# EAGLE schematic 16 seg display board (EAGLE 9.6.1)
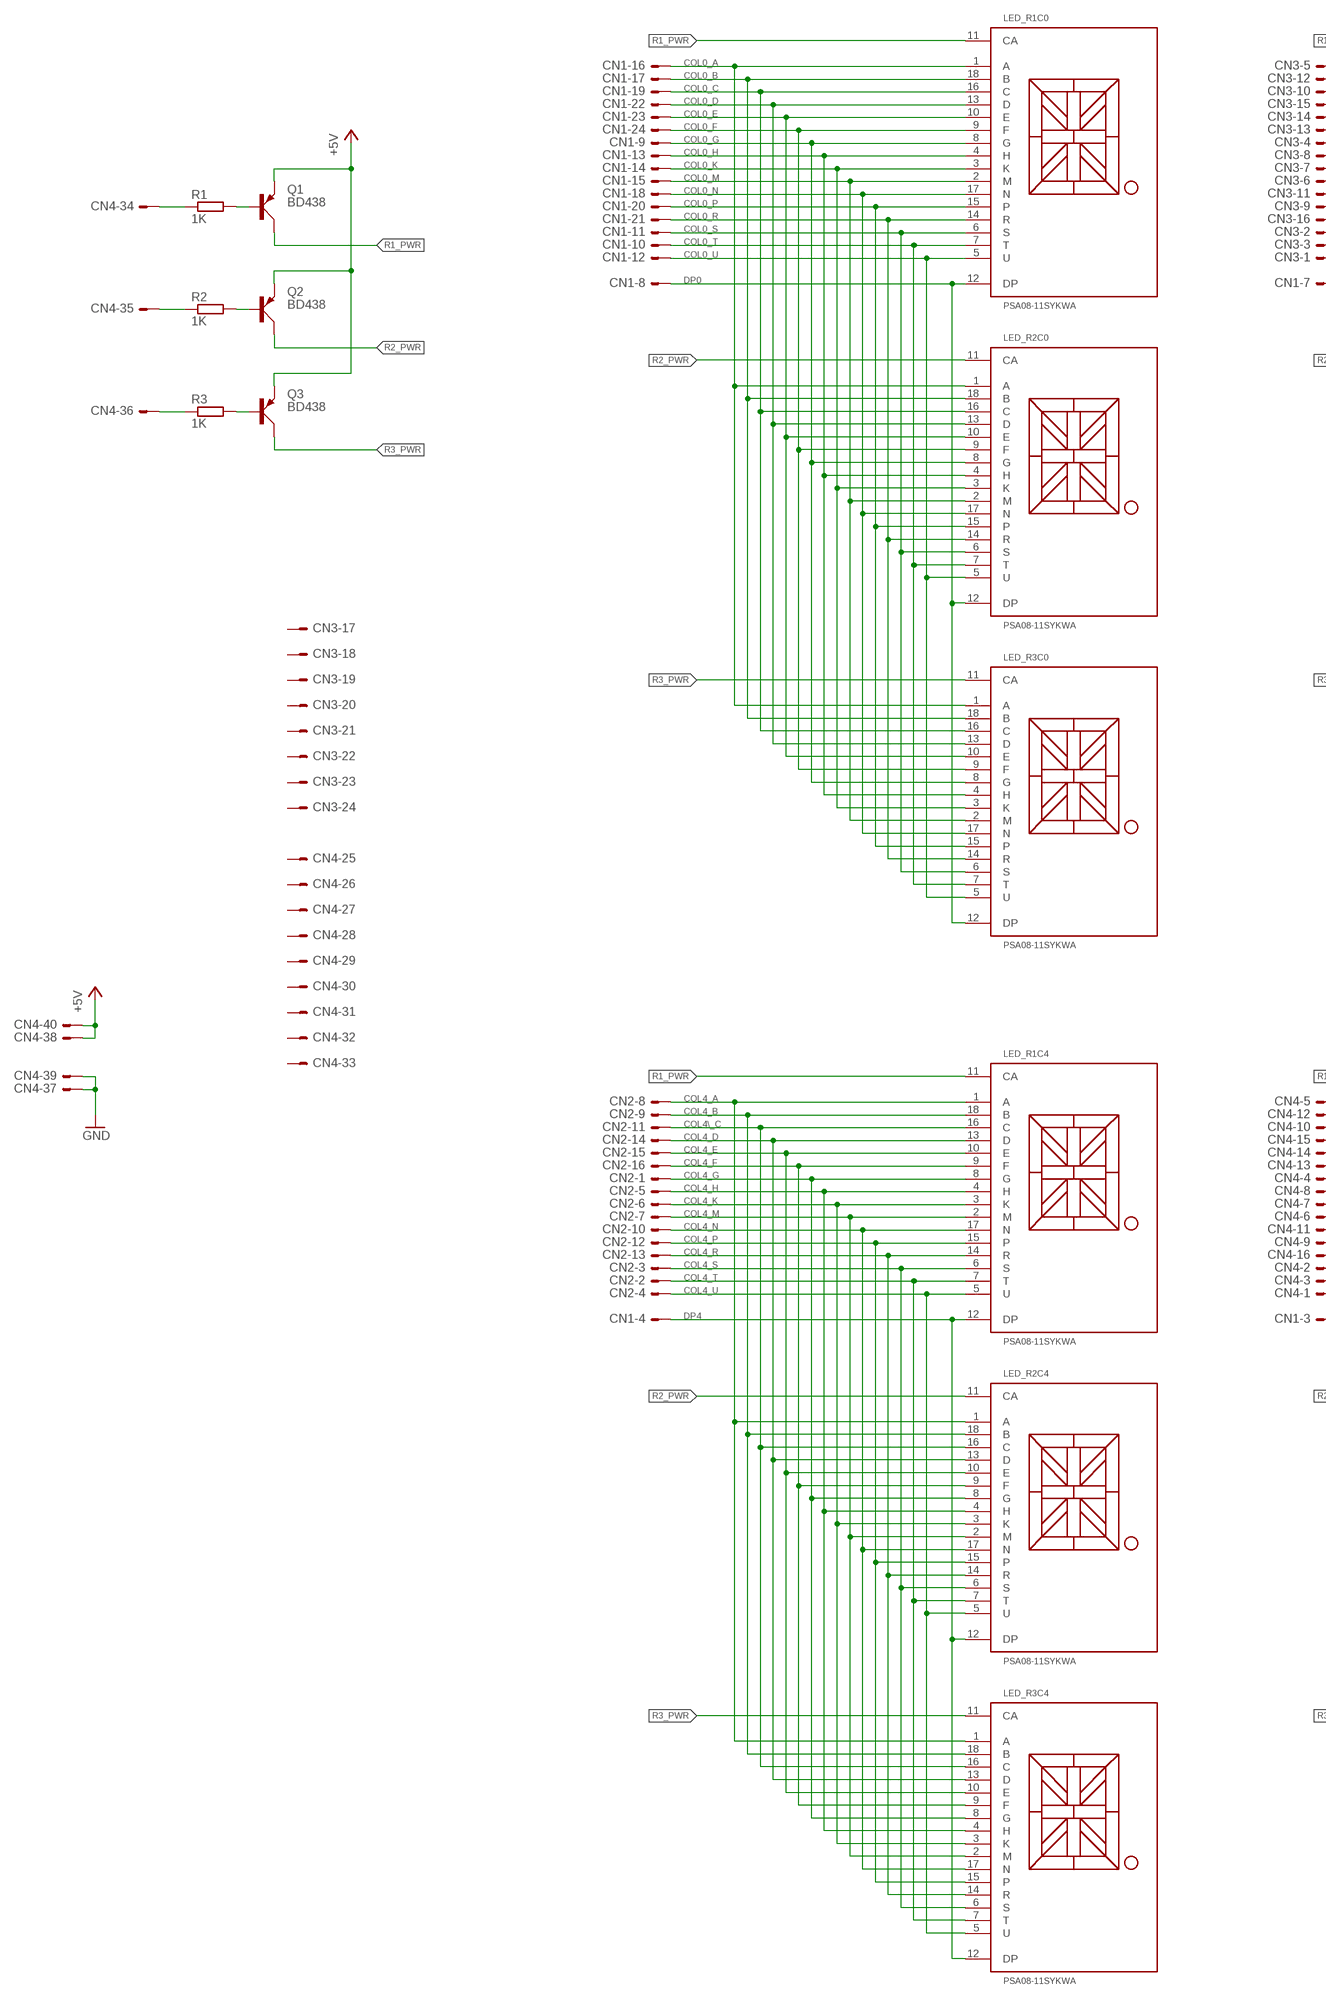
[diagram p0: schematic, sheet 1, part 1 of 2]
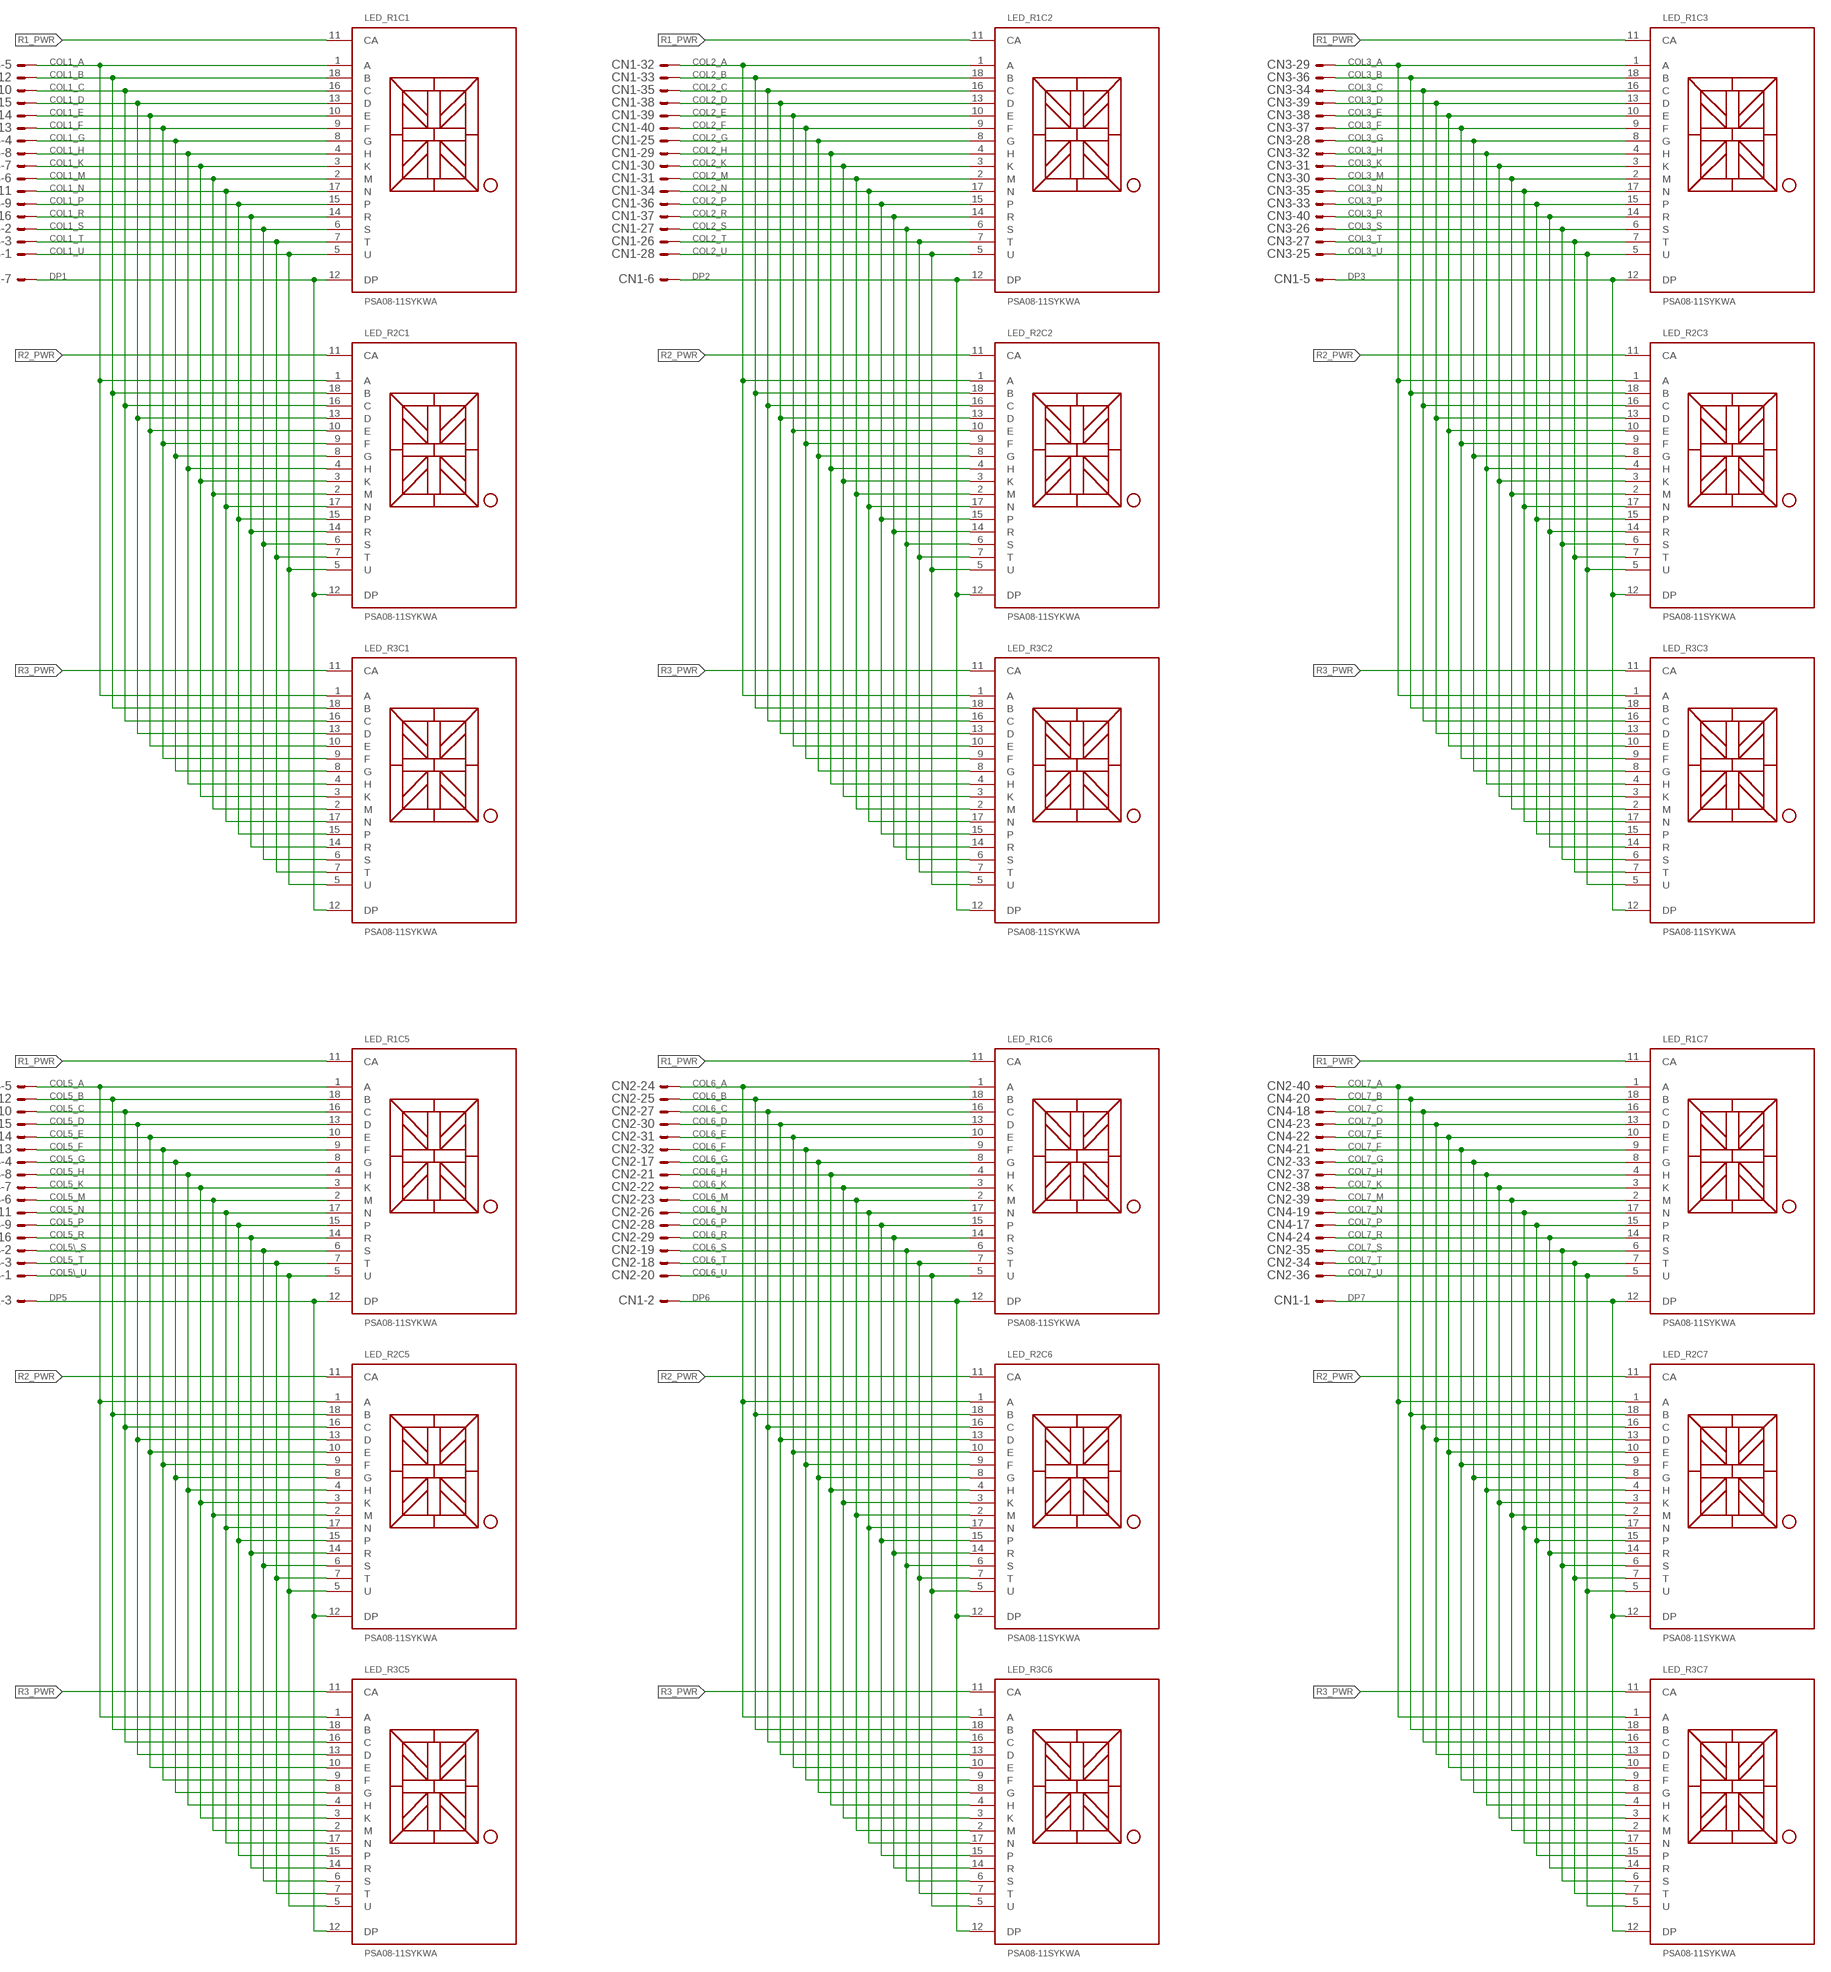
[diagram p1: schematic, sheet 1, part 2 of 2]

## Parts
CN1  HDR40  [HDR40]
CN2  HDR40  [HDR40]
CN3  HDR40  [HDR40]
CN4  HDR40  [HDR40]
LED_R1C0  PSA08-11SYKWA  [PSA08-11SYKWA]
LED_R1C1  PSA08-11SYKWA  [PSA08-11SYKWA]
LED_R1C2  PSA08-11SYKWA  [PSA08-11SYKWA]
LED_R1C3  PSA08-11SYKWA  [PSA08-11SYKWA]
LED_R1C4  PSA08-11SYKWA  [PSA08-11SYKWA]
LED_R1C5  PSA08-11SYKWA  [PSA08-11SYKWA]
LED_R1C6  PSA08-11SYKWA  [PSA08-11SYKWA]
LED_R1C7  PSA08-11SYKWA  [PSA08-11SYKWA]
LED_R2C0  PSA08-11SYKWA  [PSA08-11SYKWA]
LED_R2C1  PSA08-11SYKWA  [PSA08-11SYKWA]
LED_R2C2  PSA08-11SYKWA  [PSA08-11SYKWA]
LED_R2C3  PSA08-11SYKWA  [PSA08-11SYKWA]
LED_R2C4  PSA08-11SYKWA  [PSA08-11SYKWA]
LED_R2C5  PSA08-11SYKWA  [PSA08-11SYKWA]
LED_R2C6  PSA08-11SYKWA  [PSA08-11SYKWA]
LED_R2C7  PSA08-11SYKWA  [PSA08-11SYKWA]
LED_R3C0  PSA08-11SYKWA  [PSA08-11SYKWA]
LED_R3C1  PSA08-11SYKWA  [PSA08-11SYKWA]
LED_R3C2  PSA08-11SYKWA  [PSA08-11SYKWA]
LED_R3C3  PSA08-11SYKWA  [PSA08-11SYKWA]
LED_R3C4  PSA08-11SYKWA  [PSA08-11SYKWA]
LED_R3C5  PSA08-11SYKWA  [PSA08-11SYKWA]
LED_R3C6  PSA08-11SYKWA  [PSA08-11SYKWA]
LED_R3C7  PSA08-11SYKWA  [PSA08-11SYKWA]
Q1  BD438  [TO126AV]
Q2  BD438  [TO126AV]
Q3  BD438  [TO126AV]
R1  1K  R-EU_0207/10  [0207/10]
R2  1K  R-EU_0207/10  [0207/10]
R3  1K  R-EU_0207/10  [0207/10]

## Nets
+5V: CN4.38 CN4.40 Q1.E Q2.E Q3.E
COL0_A: CN1.16 LED_R1C0.1(A) LED_R2C0.1(A) LED_R3C0.1(A)
COL0_B: CN1.17 LED_R1C0.18(B) LED_R2C0.18(B) LED_R3C0.18(B)
COL0_C: CN1.19 LED_R1C0.16(C) LED_R2C0.16(C) LED_R3C0.16(C)
COL0_D: CN1.22 LED_R1C0.13(D) LED_R2C0.13(D) LED_R3C0.13(D)
COL0_E: CN1.23 LED_R1C0.10(E) LED_R2C0.10(E) LED_R3C0.10(E)
COL0_F: CN1.24 LED_R1C0.9(F) LED_R2C0.9(F) LED_R3C0.9(F)
COL0_G: CN1.9 LED_R1C0.8(G) LED_R2C0.8(G) LED_R3C0.8(G)
COL0_H: CN1.13 LED_R1C0.4(H) LED_R2C0.4(H) LED_R3C0.4(H)
COL0_K: CN1.14 LED_R1C0.3(K) LED_R2C0.3(K) LED_R3C0.3(K)
COL0_M: CN1.15 LED_R1C0.2(M) LED_R2C0.2(M) LED_R3C0.2(M)
COL0_N: CN1.18 LED_R1C0.17(N) LED_R2C0.17(N) LED_R3C0.17(N)
COL0_P: CN1.20 LED_R1C0.15(P) LED_R2C0.15(P) LED_R3C0.15(P)
COL0_R: CN1.21 LED_R1C0.14(R) LED_R2C0.14(R) LED_R3C0.14(R)
COL0_S: CN1.11 LED_R1C0.6(S) LED_R2C0.6(S) LED_R3C0.6(S)
COL0_T: CN1.10 LED_R1C0.7(T) LED_R2C0.7(T) LED_R3C0.7(T)
COL0_U: CN1.12 LED_R1C0.5(U) LED_R2C0.5(U) LED_R3C0.5(U)
COL1_A: CN3.5 LED_R1C1.1(A) LED_R2C1.1(A) LED_R3C1.1(A)
COL1_B: CN3.12 LED_R1C1.18(B) LED_R2C1.18(B) LED_R3C1.18(B)
COL1_C: CN3.10 LED_R1C1.16(C) LED_R2C1.16(C) LED_R3C1.16(C)
COL1_D: CN3.15 LED_R1C1.13(D) LED_R2C1.13(D) LED_R3C1.13(D)
COL1_E: CN3.14 LED_R1C1.10(E) LED_R2C1.10(E) LED_R3C1.10(E)
COL1_F: CN3.13 LED_R1C1.9(F) LED_R2C1.9(F) LED_R3C1.9(F)
COL1_G: CN3.4 LED_R1C1.8(G) LED_R2C1.8(G) LED_R3C1.8(G)
COL1_H: CN3.8 LED_R1C1.4(H) LED_R2C1.4(H) LED_R3C1.4(H)
COL1_K: CN3.7 LED_R1C1.3(K) LED_R2C1.3(K) LED_R3C1.3(K)
COL1_M: CN3.6 LED_R1C1.2(M) LED_R2C1.2(M) LED_R3C1.2(M)
COL1_N: CN3.11 LED_R1C1.17(N) LED_R2C1.17(N) LED_R3C1.17(N)
COL1_P: CN3.9 LED_R1C1.15(P) LED_R2C1.15(P) LED_R3C1.15(P)
COL1_R: CN3.16 LED_R1C1.14(R) LED_R2C1.14(R) LED_R3C1.14(R)
COL1_S: CN3.2 LED_R1C1.6(S) LED_R2C1.6(S) LED_R3C1.6(S)
COL1_T: CN3.3 LED_R1C1.7(T) LED_R2C1.7(T) LED_R3C1.7(T)
COL1_U: CN3.1 LED_R1C1.5(U) LED_R2C1.5(U) LED_R3C1.5(U)
COL2_A: CN1.32 LED_R1C2.1(A) LED_R2C2.1(A) LED_R3C2.1(A)
COL2_B: CN1.33 LED_R1C2.18(B) LED_R2C2.18(B) LED_R3C2.18(B)
COL2_C: CN1.35 LED_R1C2.16(C) LED_R2C2.16(C) LED_R3C2.16(C)
COL2_D: CN1.38 LED_R1C2.13(D) LED_R2C2.13(D) LED_R3C2.13(D)
COL2_E: CN1.39 LED_R1C2.10(E) LED_R2C2.10(E) LED_R3C2.10(E)
COL2_F: CN1.40 LED_R1C2.9(F) LED_R2C2.9(F) LED_R3C2.9(F)
COL2_G: CN1.25 LED_R1C2.8(G) LED_R2C2.8(G) LED_R3C2.8(G)
COL2_H: CN1.29 LED_R1C2.4(H) LED_R2C2.4(H) LED_R3C2.4(H)
COL2_K: CN1.30 LED_R1C2.3(K) LED_R2C2.3(K) LED_R3C2.3(K)
COL2_M: CN1.31 LED_R1C2.2(M) LED_R2C2.2(M) LED_R3C2.2(M)
COL2_N: CN1.34 LED_R1C2.17(N) LED_R2C2.17(N) LED_R3C2.17(N)
COL2_P: CN1.36 LED_R1C2.15(P) LED_R2C2.15(P) LED_R3C2.15(P)
COL2_R: CN1.37 LED_R1C2.14(R) LED_R2C2.14(R) LED_R3C2.14(R)
COL2_S: CN1.27 LED_R1C2.6(S) LED_R2C2.6(S) LED_R3C2.6(S)
COL2_T: CN1.26 LED_R1C2.7(T) LED_R2C2.7(T) LED_R3C2.7(T)
COL2_U: CN1.28 LED_R1C2.5(U) LED_R2C2.5(U) LED_R3C2.5(U)
COL3_A: CN3.29 LED_R1C3.1(A) LED_R2C3.1(A) LED_R3C3.1(A)
COL3_B: CN3.36 LED_R1C3.18(B) LED_R2C3.18(B) LED_R3C3.18(B)
COL3_C: CN3.34 LED_R1C3.16(C) LED_R2C3.16(C) LED_R3C3.16(C)
COL3_D: CN3.39 LED_R1C3.13(D) LED_R2C3.13(D) LED_R3C3.13(D)
COL3_E: CN3.38 LED_R1C3.10(E) LED_R2C3.10(E) LED_R3C3.10(E)
COL3_F: CN3.37 LED_R1C3.9(F) LED_R2C3.9(F) LED_R3C3.9(F)
COL3_G: CN3.28 LED_R1C3.8(G) LED_R2C3.8(G) LED_R3C3.8(G)
COL3_H: CN3.32 LED_R1C3.4(H) LED_R2C3.4(H) LED_R3C3.4(H)
COL3_K: CN3.31 LED_R1C3.3(K) LED_R2C3.3(K) LED_R3C3.3(K)
COL3_M: CN3.30 LED_R1C3.2(M) LED_R2C3.2(M) LED_R3C3.2(M)
COL3_N: CN3.35 LED_R1C3.17(N) LED_R2C3.17(N) LED_R3C3.17(N)
COL3_P: CN3.33 LED_R1C3.15(P) LED_R2C3.15(P) LED_R3C3.15(P)
COL3_R: CN3.40 LED_R1C3.14(R) LED_R2C3.14(R) LED_R3C3.14(R)
COL3_S: CN3.26 LED_R1C3.6(S) LED_R2C3.6(S) LED_R3C3.6(S)
COL3_T: CN3.27 LED_R1C3.7(T) LED_R2C3.7(T) LED_R3C3.7(T)
COL3_U: CN3.25 LED_R1C3.5(U) LED_R2C3.5(U) LED_R3C3.5(U)
COL4\_C: CN2.11 LED_R1C4.16(C) LED_R2C4.16(C) LED_R3C4.16(C)
COL4_A: CN2.8 LED_R1C4.1(A) LED_R2C4.1(A) LED_R3C4.1(A)
COL4_B: CN2.9 LED_R1C4.18(B) LED_R2C4.18(B) LED_R3C4.18(B)
COL4_D: CN2.14 LED_R1C4.13(D) LED_R2C4.13(D) LED_R3C4.13(D)
COL4_E: CN2.15 LED_R1C4.10(E) LED_R2C4.10(E) LED_R3C4.10(E)
COL4_F: CN2.16 LED_R1C4.9(F) LED_R2C4.9(F) LED_R3C4.9(F)
COL4_G: CN2.1 LED_R1C4.8(G) LED_R2C4.8(G) LED_R3C4.8(G)
COL4_H: CN2.5 LED_R1C4.4(H) LED_R2C4.4(H) LED_R3C4.4(H)
COL4_K: CN2.6 LED_R1C4.3(K) LED_R2C4.3(K) LED_R3C4.3(K)
COL4_M: CN2.7 LED_R1C4.2(M) LED_R2C4.2(M) LED_R3C4.2(M)
COL4_N: CN2.10 LED_R1C4.17(N) LED_R2C4.17(N) LED_R3C4.17(N)
COL4_P: CN2.12 LED_R1C4.15(P) LED_R2C4.15(P) LED_R3C4.15(P)
COL4_R: CN2.13 LED_R1C4.14(R) LED_R2C4.14(R) LED_R3C4.14(R)
COL4_S: CN2.3 LED_R1C4.6(S) LED_R2C4.6(S) LED_R3C4.6(S)
COL4_T: CN2.2 LED_R1C4.7(T) LED_R2C4.7(T) LED_R3C4.7(T)
COL4_U: CN2.4 LED_R1C4.5(U) LED_R2C4.5(U) LED_R3C4.5(U)
COL5\_S: CN4.2 LED_R1C5.6(S) LED_R2C5.6(S) LED_R3C5.6(S)
COL5\_U: CN4.1 LED_R1C5.5(U) LED_R2C5.5(U) LED_R3C5.5(U)
COL5_A: CN4.5 LED_R1C5.1(A) LED_R2C5.1(A) LED_R3C5.1(A)
COL5_B: CN4.12 LED_R1C5.18(B) LED_R2C5.18(B) LED_R3C5.18(B)
COL5_C: CN4.10 LED_R1C5.16(C) LED_R2C5.16(C) LED_R3C5.16(C)
COL5_D: CN4.15 LED_R1C5.13(D) LED_R2C5.13(D) LED_R3C5.13(D)
COL5_E: CN4.14 LED_R1C5.10(E) LED_R2C5.10(E) LED_R3C5.10(E)
COL5_F: CN4.13 LED_R1C5.9(F) LED_R2C5.9(F) LED_R3C5.9(F)
COL5_G: CN4.4 LED_R1C5.8(G) LED_R2C5.8(G) LED_R3C5.8(G)
COL5_H: CN4.8 LED_R1C5.4(H) LED_R2C5.4(H) LED_R3C5.4(H)
COL5_K: CN4.7 LED_R1C5.3(K) LED_R2C5.3(K) LED_R3C5.3(K)
COL5_M: CN4.6 LED_R1C5.2(M) LED_R2C5.2(M) LED_R3C5.2(M)
COL5_N: CN4.11 LED_R1C5.17(N) LED_R2C5.17(N) LED_R3C5.17(N)
COL5_P: CN4.9 LED_R1C5.15(P) LED_R2C5.15(P) LED_R3C5.15(P)
COL5_R: CN4.16 LED_R1C5.14(R) LED_R2C5.14(R) LED_R3C5.14(R)
COL5_T: CN4.3 LED_R1C5.7(T) LED_R2C5.7(T) LED_R3C5.7(T)
COL6_A: CN2.24 LED_R1C6.1(A) LED_R2C6.1(A) LED_R3C6.1(A)
COL6_B: CN2.25 LED_R1C6.18(B) LED_R2C6.18(B) LED_R3C6.18(B)
COL6_C: CN2.27 LED_R1C6.16(C) LED_R2C6.16(C) LED_R3C6.16(C)
COL6_D: CN2.30 LED_R1C6.13(D) LED_R2C6.13(D) LED_R3C6.13(D)
COL6_E: CN2.31 LED_R1C6.10(E) LED_R2C6.10(E) LED_R3C6.10(E)
COL6_F: CN2.32 LED_R1C6.9(F) LED_R2C6.9(F) LED_R3C6.9(F)
COL6_G: CN2.17 LED_R1C6.8(G) LED_R2C6.8(G) LED_R3C6.8(G)
COL6_H: CN2.21 LED_R1C6.4(H) LED_R2C6.4(H) LED_R3C6.4(H)
COL6_K: CN2.22 LED_R1C6.3(K) LED_R2C6.3(K) LED_R3C6.3(K)
COL6_M: CN2.23 LED_R1C6.2(M) LED_R2C6.2(M) LED_R3C6.2(M)
COL6_N: CN2.26 LED_R1C6.17(N) LED_R2C6.17(N) LED_R3C6.17(N)
COL6_P: CN2.28 LED_R1C6.15(P) LED_R2C6.15(P) LED_R3C6.15(P)
COL6_R: CN2.29 LED_R1C6.14(R) LED_R2C6.14(R) LED_R3C6.14(R)
COL6_S: CN2.19 LED_R1C6.6(S) LED_R2C6.6(S) LED_R3C6.6(S)
COL6_T: CN2.18 LED_R1C6.7(T) LED_R2C6.7(T) LED_R3C6.7(T)
COL6_U: CN2.20 LED_R1C6.5(U) LED_R2C6.5(U) LED_R3C6.5(U)
COL7_A: CN2.40 LED_R1C7.1(A) LED_R2C7.1(A) LED_R3C7.1(A)
COL7_B: CN4.20 LED_R1C7.18(B) LED_R2C7.18(B) LED_R3C7.18(B)
COL7_C: CN4.18 LED_R1C7.16(C) LED_R2C7.16(C) LED_R3C7.16(C)
COL7_D: CN4.23 LED_R1C7.13(D) LED_R2C7.13(D) LED_R3C7.13(D)
COL7_E: CN4.22 LED_R1C7.10(E) LED_R2C7.10(E) LED_R3C7.10(E)
COL7_F: CN4.21 LED_R1C7.9(F) LED_R2C7.9(F) LED_R3C7.9(F)
COL7_G: CN2.33 LED_R1C7.8(G) LED_R2C7.8(G) LED_R3C7.8(G)
COL7_H: CN2.37 LED_R1C7.4(H) LED_R2C7.4(H) LED_R3C7.4(H)
COL7_K: CN2.38 LED_R1C7.3(K) LED_R2C7.3(K) LED_R3C7.3(K)
COL7_M: CN2.39 LED_R1C7.2(M) LED_R2C7.2(M) LED_R3C7.2(M)
COL7_N: CN4.19 LED_R1C7.17(N) LED_R2C7.17(N) LED_R3C7.17(N)
COL7_P: CN4.17 LED_R1C7.15(P) LED_R2C7.15(P) LED_R3C7.15(P)
COL7_R: CN4.24 LED_R1C7.14(R) LED_R2C7.14(R) LED_R3C7.14(R)
COL7_S: CN2.35 LED_R1C7.6(S) LED_R2C7.6(S) LED_R3C7.6(S)
COL7_T: CN2.34 LED_R1C7.7(T) LED_R2C7.7(T) LED_R3C7.7(T)
COL7_U: CN2.36 LED_R1C7.5(U) LED_R2C7.5(U) LED_R3C7.5(U)
DP0: CN1.8 LED_R1C0.12(DP) LED_R2C0.12(DP) LED_R3C0.12(DP)
DP1: CN1.7 LED_R1C1.12(DP) LED_R2C1.12(DP) LED_R3C1.12(DP)
DP2: CN1.6 LED_R1C2.12(DP) LED_R2C2.12(DP) LED_R3C2.12(DP)
DP3: CN1.5 LED_R1C3.12(DP) LED_R2C3.12(DP) LED_R3C3.12(DP)
DP4: CN1.4 LED_R1C4.12(DP) LED_R2C4.12(DP) LED_R3C4.12(DP)
DP5: CN1.3 LED_R1C5.12(DP) LED_R2C5.12(DP) LED_R3C5.12(DP)
DP6: CN1.2 LED_R1C6.12(DP) LED_R2C6.12(DP) LED_R3C6.12(DP)
DP7: CN1.1 LED_R1C7.12(DP) LED_R2C7.12(DP) LED_R3C7.12(DP)
GND: CN4.37 CN4.39
N$1: Q1.B R1.2
N$2: Q2.B R2.2
N$3: Q3.B R3.2
N$4: CN4.34 R1.1
N$5: CN4.35 R2.1
N$6: CN4.36 R3.1
R1_PWR: LED_R1C0.11(CA) LED_R1C1.11(CA) LED_R1C2.11(CA) LED_R1C3.11(CA) LED_R1C4.11(CA) LED_R1C5.11(CA) LED_R1C6.11(CA) LED_R1C7.11(CA) Q1.C
R2_PWR: LED_R2C0.11(CA) LED_R2C1.11(CA) LED_R2C2.11(CA) LED_R2C3.11(CA) LED_R2C4.11(CA) LED_R2C5.11(CA) LED_R2C6.11(CA) LED_R2C7.11(CA) Q2.C
R3_PWR: LED_R3C0.11(CA) LED_R3C1.11(CA) LED_R3C2.11(CA) LED_R3C3.11(CA) LED_R3C4.11(CA) LED_R3C5.11(CA) LED_R3C6.11(CA) LED_R3C7.11(CA) Q3.C
Unconnected: CN3.17 CN3.18 CN3.19 CN3.20 CN3.21 CN3.22 CN3.23 CN3.24 CN4.25 CN4.26 CN4.27 CN4.28 CN4.29 CN4.30 CN4.31 CN4.32 CN4.33

## Library data of the parts
CN1-CN4 = Z80 clock:HDR40
LED_R1C0 LED_R1C1-LED_R1C7 LED_R2C0 LED_R2C1-LED_R2C7 LED_R3C0 LED_R3C1-LED_R3C7 = Z80 clock:PSA08-11SYKWA
Q1-Q3 = transistor-power:BD438: PNP TRANSISTOR
R1-R3 = rcl:R-EU_: RESISTOR, European symbol